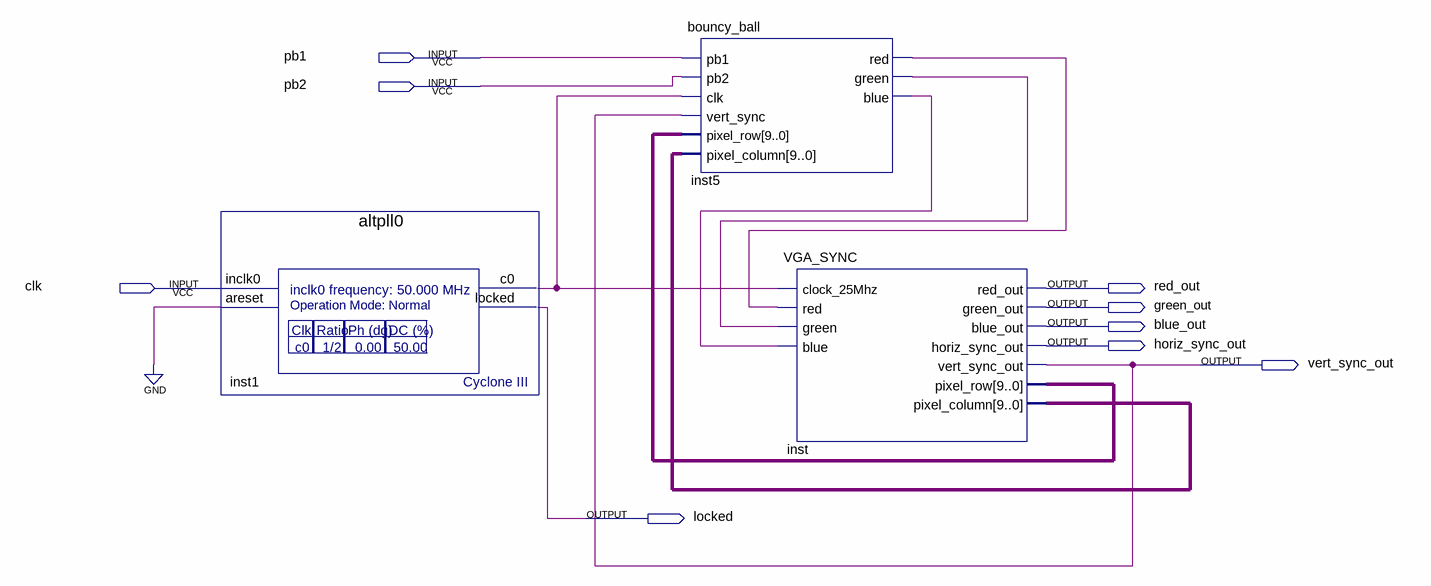
[diagram p0: schematic sheet]
// Quartus schematic ball.bdf as structural Verilog: 3 symbols, 9 pins
module ball (
  input  pb1,
  input  pb2,
  input  clk,
  output red_out,
  output green_out,
  output blue_out,
  output horiz_sync_out,
  output vert_sync_out,
  output locked
);

  wire inst1_c0, inst5_blue, inst5_green, inst5_red;
  wire [9:0] inst_pixel_column, inst_pixel_row;

  altpll0 inst1 (.inclk0(clk), .areset(1'b0), .c0(inst1_c0), .locked(locked));
  bouncy_ball inst5 (
    .pb1(pb1), .pb2(pb2), .clk(inst1_c0), .vert_sync(vert_sync_out), .pixel_row(inst_pixel_row),
    .pixel_column(inst_pixel_column), .red(inst5_red), .green(inst5_green), .blue(inst5_blue));
  VGA_SYNC inst (
    .clock_25Mhz(inst1_c0), .red(inst5_red), .green(inst5_green), .blue(inst5_blue), .red_out(red_out),
    .green_out(green_out), .blue_out(blue_out), .horiz_sync_out(horiz_sync_out),
    .vert_sync_out(vert_sync_out), .pixel_row(inst_pixel_row), .pixel_column(inst_pixel_column));
endmodule
